# Altium schematic sheet Page_Tete.SchDoc
size A4; SheetNumber: 1; SheetTotal: 4
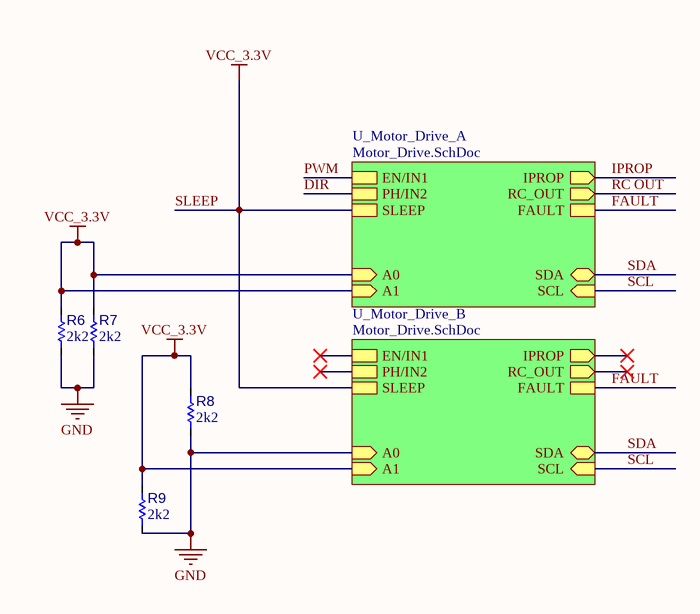
[diagram p0: Page_Tete.SchDoc]

## Parts
R6  value 2k2  [R_1005[0402]]  (hidden comment: Res 2k2 1% 0402)
R7  value 2k2  [R_1005[0402]]  (hidden comment: Res 2k2 1% 0402)
R8  value 2k2  [R_1005[0402]]  (hidden comment: Res 2k2 1% 0402)
R9  value 2k2  [R_1005[0402]]  (hidden comment: Res 2k2 1% 0402)

## Sub-sheets
U_Motor_Drive_A = Motor_Drive.SchDoc: EN/IN1, PH/IN2, SLEEP, IPROP (out), FAULT, SCL (in), SDA (bidir), A0 (in), A1 (in), RC_OUT (out)
U_Motor_Drive_B = Motor_Drive.SchDoc: EN/IN1, PH/IN2, SLEEP, IPROP (out), FAULT, SCL (in), SDA (bidir), A0 (in), A1 (in), RC_OUT (out)

## Nets
GND: R6.1 R7.1 R8.1 R9.1 ; sheet U_Motor_Drive_B/A0
SLEEP: R6.2 R7.2 R8.2 R9.2 ; sheet U_Motor_Drive_A/SLEEP, sheet U_Motor_Drive_A/A0, sheet U_Motor_Drive_A/A1, sheet U_Motor_Drive_B/SLEEP, sheet U_Motor_Drive_B/A1  [also labelled VCC_3.3V]
DIR: sheet U_Motor_Drive_A/PH/IN2
FAULT: sheet U_Motor_Drive_A/FAULT, sheet U_Motor_Drive_B/FAULT
IPROP: sheet U_Motor_Drive_A/IPROP
PWM: sheet U_Motor_Drive_A/EN/IN1
RC OUT: sheet U_Motor_Drive_A/RC_OUT
SCL: sheet U_Motor_Drive_A/SCL, sheet U_Motor_Drive_B/SCL
SDA: sheet U_Motor_Drive_A/SDA, sheet U_Motor_Drive_B/SDA

## Library data of the parts
R6-R9 = RES008: Resistor type 1; Manufacturer 1: Yageo; Manufacturer Part Number 1: RC0402FR-072K2L; LibRef: RES008; Code CEGEP: RES2.2KSM; Puissance: 1/16W; Max Working Voltage: 50V; Tolerance: 1%; Mounting Technology: SMT; Supplier 1: LCSC; Supplier Part Number 1: C114762; Supplier 2: Digi-Key; Supplier Part Number 2: 311-2.20KLRCT-ND